# EAGLE schematic test (EAGLE 9.5.1)
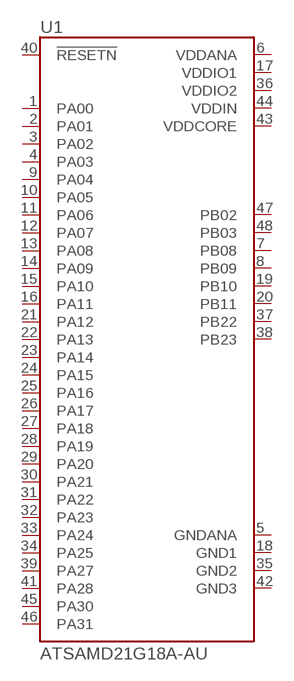
[diagram p0: schematic, sheet 1]

## Parts
U1  ATSAMD21G18A-AU  [QFP50P900X900X120-48N]
Unconnected: U1.1(PA00) U1.2(PA01) U1.3(PA02) U1.4(PA03) U1.7(PB08) U1.8(PB09) U1.9(PA04) U1.10(PA05) U1.11(PA06) U1.12(PA07) U1.13(PA08) U1.14(PA09) U1.15(PA10) U1.16(PA11) U1.19(PB10) U1.20(PB11) U1.21(PA12) U1.22(PA13) U1.23(PA14) U1.24(PA15) U1.25(PA16) U1.26(PA17) U1.27(PA18) U1.28(PA19) U1.29(PA20) U1.30(PA21) U1.31(PA22) U1.32(PA23) U1.33(PA24) U1.34(PA25) U1.37(PB22) U1.38(PB23) U1.39(PA27) U1.40(!RESETN) U1.41(PA28) U1.45(PA30) U1.46(PA31) U1.47(PB02) U1.48(PB03)

## Power pins joined to a net without a drawn wire
GND1: U1.18(GND1)
GND2: U1.35(GND2)
GND3: U1.42(GND3)
GNDANA: U1.5(GNDANA)
VDDANA: U1.6(VDDANA)
VDDCORE: U1.43(VDDCORE)
VDDIN: U1.44(VDDIN)
VDDIO1: U1.17(VDDIO1)
VDDIO2: U1.36(VDDIO2)

## Library data of the parts
U1 = ATSAMD21G18A-AU:ATSAMD21G18A-AU: Cortex-M0+, 256KB FLASH, 32KB SRAM, USB, DMA, T&R - 48TQFP IND TEMP, GREEN, 1.6-3.6V, 48MHz; AVAILABILITY: Unavailable; DESCRIPTION: SAMD21G Series 256 kB Flash 32 kB SRAM 48 MHz 32-Bit Microcontroller - TQFP-48; MF: Microchip; MP: ATSAMD21G18A-AU; PACKAGE: TQFP-48 Microchip; PRICE: None